# EAGLE design untitled (EAGLE 9.6.2)
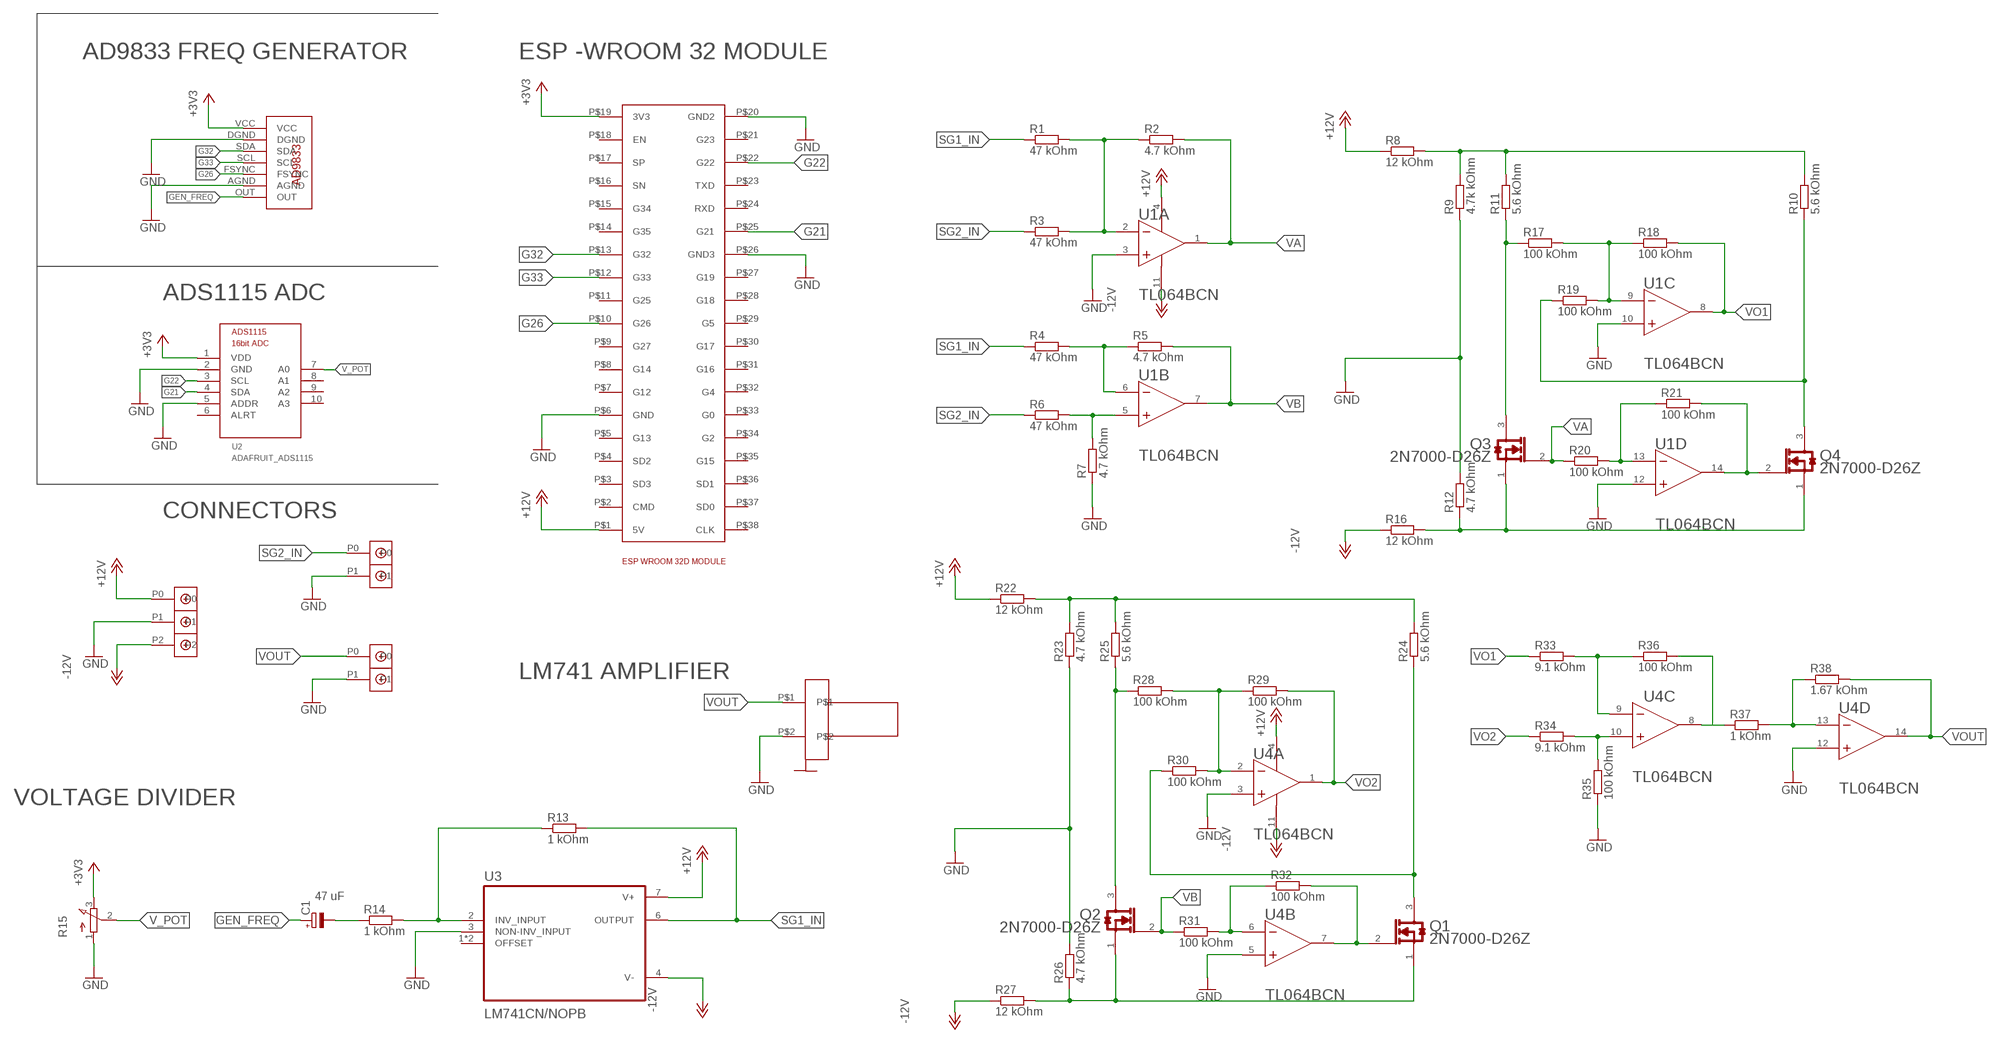
[diagram p0: schematic, sheet 1]

## Parts
C1  47 uF  CPOL-EUE1.8-4  [E1,8-4]
Q1  ON_SEMICONDUCTOR_2N7000-D26ZON_SEMICONDUCTOR_2N7000-D26Z_0_0  [ON_SEMICONDUCTOR_2N7000-D26Z_0]
Q2  ON_SEMICONDUCTOR_2N7000-D26ZON_SEMICONDUCTOR_2N7000-D26Z_0_0  [ON_SEMICONDUCTOR_2N7000-D26Z_0]
Q3  ON_SEMICONDUCTOR_2N7000-D26ZON_SEMICONDUCTOR_2N7000-D26Z_0_0  [ON_SEMICONDUCTOR_2N7000-D26Z_0]
Q4  ON_SEMICONDUCTOR_2N7000-D26ZON_SEMICONDUCTOR_2N7000-D26Z_0_0  [ON_SEMICONDUCTOR_2N7000-D26Z_0]
R1  47 kOhm  R-EU_0204/7  [0204/7]
R2  4.7 kOhm  R-EU_0204/7  [0204/7]
R3  47 kOhm  R-EU_0204/7  [0204/7]
R4  47 kOhm  R-EU_0204/7  [0204/7]
R5  4.7 kOhm  R-EU_0204/7  [0204/7]
R6  47 kOhm  R-EU_0204/7  [0204/7]
R7  4.7 kOhm  R-EU_0204/7  [0204/7]
R8  12 kOhm  R-EU_0204/7  [0204/7]
R9  4.7k kOhm  R-EU_0204/7  [0204/7]
R10  5.6 kOhm  R-EU_0204/7  [0204/7]
R11  5.6 kOhm  R-EU_0204/7  [0204/7]
R12  4.7 kOhm  R-EU_0204/7  [0204/7]
R13  1 kOhm  R-EU_0204/7  [0204/7]
R14  1 kOhm  R-EU_0204/7  [0204/7]
R15  3RP/1610N  [3RP/1610N]
R16  12 kOhm  R-EU_0204/7  [0204/7]
R17  100 kOhm  R-EU_0204/7  [0204/7]
R18  100 kOhm  R-EU_0204/7  [0204/7]
R19  100 kOhm  R-EU_0204/7  [0204/7]
R20  100 kOhm  R-EU_0204/7  [0204/7]
R21  100 kOhm  R-EU_0204/7  [0204/7]
R22  12 kOhm  R-EU_0204/7  [0204/7]
R23  4.7 kOhm  R-EU_0204/7  [0204/7]
R24  5.6 kOhm  R-EU_0204/7  [0204/7]
R25  5.6 kOhm  R-EU_0204/7  [0204/7]
R26  4.7 kOhm  R-EU_0204/7  [0204/7]
R27  12 kOhm  R-EU_0204/7  [0204/7]
R28  100 kOhm  R-EU_0204/7  [0204/7]
R29  100 kOhm  R-EU_0204/7  [0204/7]
R30  100 kOhm  R-EU_0204/7  [0204/7]
R31  100 kOhm  R-EU_0204/7  [0204/7]
R32  100 kOhm  R-EU_0204/7  [0204/7]
R33  9.1 kOhm  R-EU_0204/7  [0204/7]
R34  9.1 kOhm  R-EU_0204/7  [0204/7]
R35  100 kOhm  R-EU_0204/7  [0204/7]
R36  100 kOhm  R-EU_0204/7  [0204/7]
R37  1 kOhm  R-EU_0204/7  [0204/7]
R38  1.67 kOhm  R-EU_0204/7  [0204/7]
U1  TEXAS_INSTRUMENTS_TL064BCNTEXAS_INSTRUMENTS_TL064BCN_0_0  [TEXAS_INSTRUMENTS_TL064BCN_0]
U2  ADAFRUIT_ADS1115  [ADAFRUIT_ADS1115_16BIT_I2C_ADC]
U3  LM741CN/NOPB  [DIP794W45P254L959H508Q8]
U4  TEXAS_INSTRUMENTS_TL064BCNTEXAS_INSTRUMENTS_TL064BCN_0_0  [TEXAS_INSTRUMENTS_TL064BCN_0]
U$1  ESP32  [ESP32]
U$2  A9833  [AD9833]
U$3  DBCONN-1X2  [DBCONN-1X2]
U$4  DBCONN-1X3  [DBCONN-1X3]
U$5  DBCONN-1X2  [DBCONN-1X2]
U$6  FP  [FP]

## Nets
+3V3: R15.3(E) U2.1(VDD) U$1.P$19(3V3) U$2.VCC
+12V: R8.1 R22.1 U1.4(A:VCC+) U3.7(V+) U4.4(A:VCC+) U$1.P$1(5V) U$4.P0
-12V: R16.1 R27.1 U1.11(A:VCC-) U3.4(V-) U4.11(A:VCC-) U$4.P2
G21: U2.4(SDA) U$1.P$25(G21)
G22: U2.3(SCL) U$1.P$22(G22)
G26: U$1.P$10(G26) U$2.FSYNC
G32: U$1.P$13(G32) U$2.SDA
G33: U$1.P$12(G33) U$2.SCL
GEN_FREQ: C1.+ U$2.OUT
GND: R7.1 R9.1 R12.2 R15.1(A) R23.1 R26.2 R35.1 U1.3(A:IN1+) U1.10(C:IN3+) U1.12(D:IN4+) U2.2(GND) U2.5(ADDR) U3.3(NON-INV_INPUT) U4.3(A:IN1+) U4.5(B:IN2+) U4.12(D:IN4+) U$1.P$6(GND) U$1.P$20(GND2) U$1.P$26(GND3) U$2.AGND U$2.DGND U$3.P1 U$4.P1 U$5.P1 U$6.P$2
N$1: R1.2 R2.1 R3.2 U1.2(A:IN1-)
N$2: R4.2 R5.1 U1.6(B:IN2-)
N$3: R8.2 R9.2 R10.2 R11.2
N$4: R13.1 R14.2 U3.2(INV_INPUT)
N$5: C1.- R14.1
N$6: R6.2 R7.2 U1.5(B:IN2+)
N$7: Q3.3(D) R11.1 R17.1
N$8: Q3.1(S) Q4.1(S) R12.1 R16.2
N$9: Q4.3(D) R10.1 R19.1
N$10: R37.2 R38.1 U4.13(D:IN4-)
N$11: R20.2 R21.1 U1.13(D:IN4-)
N$12: R17.2 R18.1 R19.2 U1.9(C:IN3-)
N$13: Q4.2(G) R21.2 U1.14(D:OUT4)
N$14: R22.2 R23.2 R24.2 R25.2
N$15: Q1.1(S) Q2.1(S) R26.1 R27.2
N$16: Q2.3(D) R25.1 R28.1
N$17: Q1.3(D) R24.1 R30.1
N$18: R28.2 R29.1 R30.2 U4.2(A:IN1-)
N$19: R33.2 R36.1 U4.9(C:IN3-)
N$20: R31.2 R32.1 U4.6(B:IN2-)
N$21: Q1.2(G) R32.2 U4.7(B:OUT2)
N$23: R36.2 R37.1 U4.8(C:OUT3)
N$24: R34.2 R35.2 U4.10(C:IN3+)
SG1_IN: R1.1 R4.1 R13.2 U3.6(OUTPUT)
SG2_IN: R3.1 R6.1 U$3.P0
V_POT: R15.2(S) U2.7(A0)
VA: Q3.2(G) R2.2 R20.1 U1.1(A:OUT1)
VB: Q2.2(G) R5.2 R31.1 U1.7(B:OUT2)
VO1: R18.2 R33.1 U1.8(C:OUT3)
VO2: R29.2 R34.1 U4.1(A:OUT1)
VOUT: R38.2 U4.14(D:OUT4) U$5.P0 U$6.P$1
Unconnected: U2.6(ALRT) U2.8(A1) U2.9(A2) U2.10(A3) U3.1(OFFSET) U3.5(OFFSET) U$1.P$2(CMD) U$1.P$3(SD3) U$1.P$4(SD2) U$1.P$5(G13) U$1.P$7(G12) U$1.P$8(G14) U$1.P$9(G27) U$1.P$11(G25) U$1.P$14(G35) U$1.P$15(G34) U$1.P$16(SN) U$1.P$17(SP) U$1.P$18(EN) U$1.P$21(G23) U$1.P$23(TXD) U$1.P$24(RXD) U$1.P$27(G19) U$1.P$28(G18) U$1.P$29(G5) U$1.P$30(G17) U$1.P$31(G16) U$1.P$32(G4) U$1.P$33(G0) U$1.P$34(G2) U$1.P$35(G15) U$1.P$36(SD1) U$1.P$37(SD0) U$1.P$38(CLK)

## Notes on the sheet
- AD9833 FREQ GENERATOR | ESP -WROOM 32 MODULE
- ADS1115 ADC
- CONNECTORS
- LM741 AMPLIFIER
- VOLTAGE DIVIDER

## Library data of the parts
C1 = rcl:CPOL-EU: POLARIZED CAPACITOR, European symbol; SPICEPREFIX: C
Q1-Q4 = ON Semiconductor - 2N7000-D26Z:ON_SEMICONDUCTOR_2N7000-D26Z: Transistor Mosfet N-ch 60V 0.2A 3-PIN TO-92 T/r; AUTOMOTIVE: No; CENTROID_NOT_SPECIFIED: No; CONTINUOUS_DRAIN_CURRENT: 200mA; DATASHEET: https://www.onsemi.com/pdf/datasheet/nds7002a-d.pdf; DEPLETION_MODE: False; DEVICE_CLASS_L1: Discrete Semiconductors; DEVICE_CLASS_L2: Transistors; DEVICE_CLASS_L3: MOSFETs; DIGIKEY_DESCRIPTION: MOSFET N-CH 60V 200MA TO92-3; DIGIKEY_PART_NUMBER: 2N7000-D26ZCT-ND; DRAIN_TO_SOURCE_BREAKDOWN_VOLTAGE: 60V; DRAIN_TO_SOURCE_RESISTANCE: 1.2Ω; DRAIN_TO_SOURCE_VOLTAGE: 60V; FOOTPRINT_VARIANT_NAME_0: Recommended_Land_Pattern; GATE_TO_SOURCE_VOLTAGE: 20V; HEIGHT: 8.77mm; INPUT_CAPACITACE_AT_VDS: 20pF @ 25V; LEAD_FREE: Yes; MAX_FORWARD_DIODE_VOLTAGE: 1.5V; MAX_JUNCTION_TEMP: +150°C; MF: ON Semiconductor; MFG_PACKAGE_IDENT: 135AR; MFG_PACKAGE_IDENT_COMPONENT_ID: 9652051e5763c9af; MFG_PACKAGE_IDENT_DATE: 09/2016; MFG_PACKAGE_IDENT_REV: O; MOUSER_DESCRIPTION: N-Channel 60 V 5 Ohm Enhancement Mode Field Effect Transistor-TO-92; MOUSER_PART_NUMBER: 512-2N7000D26Z; MPN: 2N7000-D26Z; NUMBER_OF_CHANNELS: 1; NUMBER_OF_N_CHANNELS: 1; PACKAGE: TO92; POWER_DISSIPATION: 400mW; PREFIX: Q; PULSE_DRAIN_CURRENT: 500mA; ROHS: Yes; RTHJA_MAX: 312.5°C/W; STANDOFF_HEIGHT: 2.54mm; TEMPERATURE_RANGE_HIGH: +150°C; TEMPERATURE_RANGE_LOW: -55°C; THRESHOLD_VGS_MAX: 3V; THRESHOLD_VGS_MIN: 0.8V; TRANSCONDUCTANCE: 0.32S; TURN_OFF_DELAY_TIME: 10ns; TURN_ON_DELAY_TIME: 10ns; TYP_FORWARD_DIODE_VOLTAGE: 0.88V; VERIFICATION_VERSION: 0.0.0.3
R1-R14 R16-R38 = rcl:R-EU_: RESISTOR, European symbol; SPICEPREFIX: R
R15 = pot:3RP/1610N: 16mm Potentiometer one level Source: http://www.alphapotentiometers.net/html/16mm_pot_2.html
U1 U4 = Texas Instruments - TL064BCN:TEXAS_INSTRUMENTS_TL064BCN: TI-TLXX4X_MC3403-X14; CIIVA_IDS: 13597074; CMRR_MIND_B: 80; CODE__JEDEC: MS-001; COMPONENT_LINK_1_DESCRIPTION: Manufacturer URL; COMPONENT_LINK_1_URL: http://www.ti.com/; COMPONENT_LINK_3_DESCRIPTION: Package Specification; COMPONENT_LINK_3_URL: http://www.ti.com/lit/ml/mpdi002c/mpdi002c.pdf; DATASHEET: http://www.ti.com/lit/ds/symlink/tl064b.pdf; DATASHEET_VERSION: SLOS078J; FOOTPRINT_VARIANT_NAME_0: Manufacturer Recommended; GBW_TYP_MHZ: 1; IIB_MAXP_A: 200; IMPORTED: yes; IMPORTED_FROM: vault; IMPORT_TS: 1521848179; IQ_PER_CHANNELMAXMA: 0.25; MF: Texas Instruments; MOUNTING_TECHNOLOGY: Through Hole; MPN: TL064BCN; NUMBER_OF_CHANNELS: 4; OFFSET_DRIFTTYPUVC: 10; PACKAGE: N0014A; PACKAGE_DESCRIPTION: 14-Pin Plastic In-Line, Body 19.305 x 6.35 mm, Pitch 2.54 mm; PACKAGE_VERSION: 4040049/E, 12/2002; PREFIX: U; RATING: Catalog; RELEASE_DATE: 1464177968; ROHS: Yes; SLEW_RATETYPVUS: 3.5; SUB_FAMILY: General Purpose Amplifier, High Supply Voltage Amplifier (>=30V), Low Power Amp (<=500uA); TOTAL_SUPPLY_VOLTAGEMAX5V_IS_5__5V_IS_10: 36; TOTAL_SUPPLY_VOLTAGEMIN5V_IS_5__5V_IS_10: 7; VAULT_GUID: 55F2E253-B78A-4D80-B08A-0007F9876C2C; VAULT_REVISION: 1256BF72-5E93-4EA1-B475-6599D60DA280; VIO_25CMAXMV: 3; VN_AT_1KHZTYPNVRTHZ: 42
U2 = ADS1115:ADAFRUIT_ADS1115
U3 = LM741CN_NOPB:LM741CN/NOPB: Check availability <https://pricing.snapeda.com/parts/LM741CN/Texas%20Instruments/view-part?ref=eda>; AVAILABILITY: In Stock; DESCRIPTION: Operational Amplifiers - Op Amps Operational Amplifier 8-PDIP 0 to 70; MF: Texas Instruments; MP: LM741CN; PACKAGE: DIP-8 NXP Semiconductors; PRICE: None; PURCHASE-URL: https://pricing.snapeda.com/search?q=LM741CN&ref=eda
U$1 = [module]ESP32:ESP32
U$2 = AD9833:A9833
U$3 U$5 = Terminal Block Connector:DBCONN-1X2
U$4 = Terminal Block Connector:DBCONN-1X3
U$6 = AUDIO MONO:FP

## Board
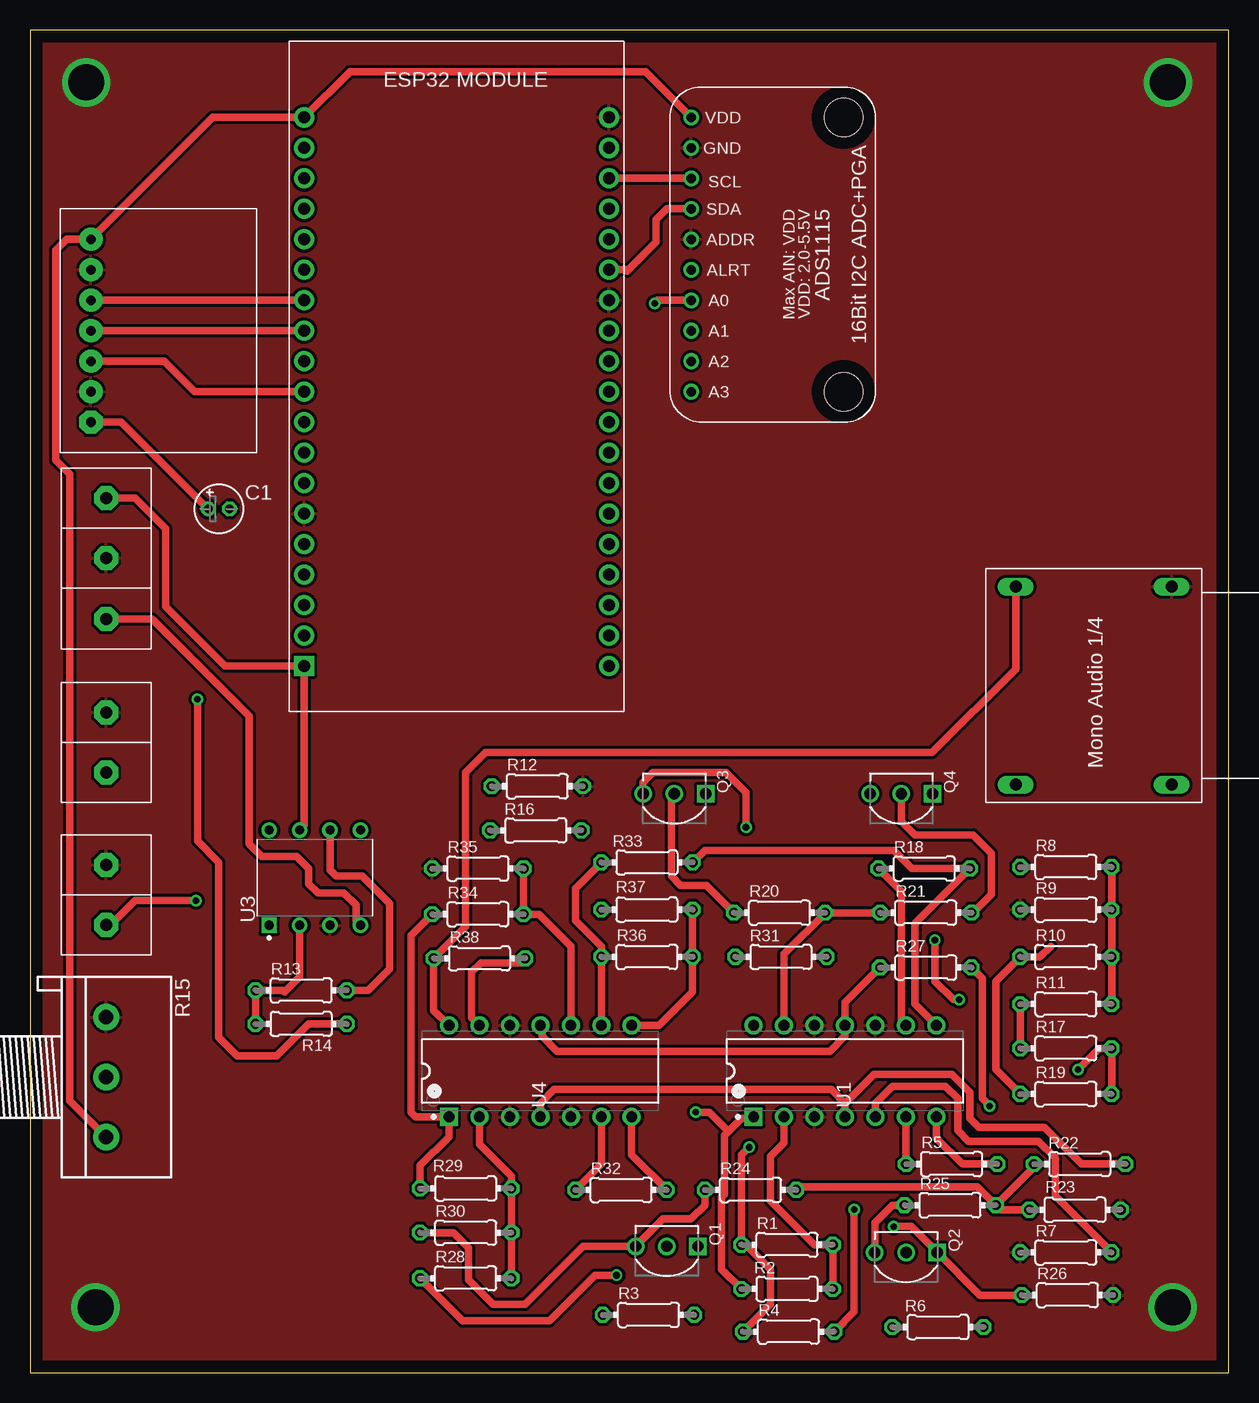
[diagram p1: board, top side]
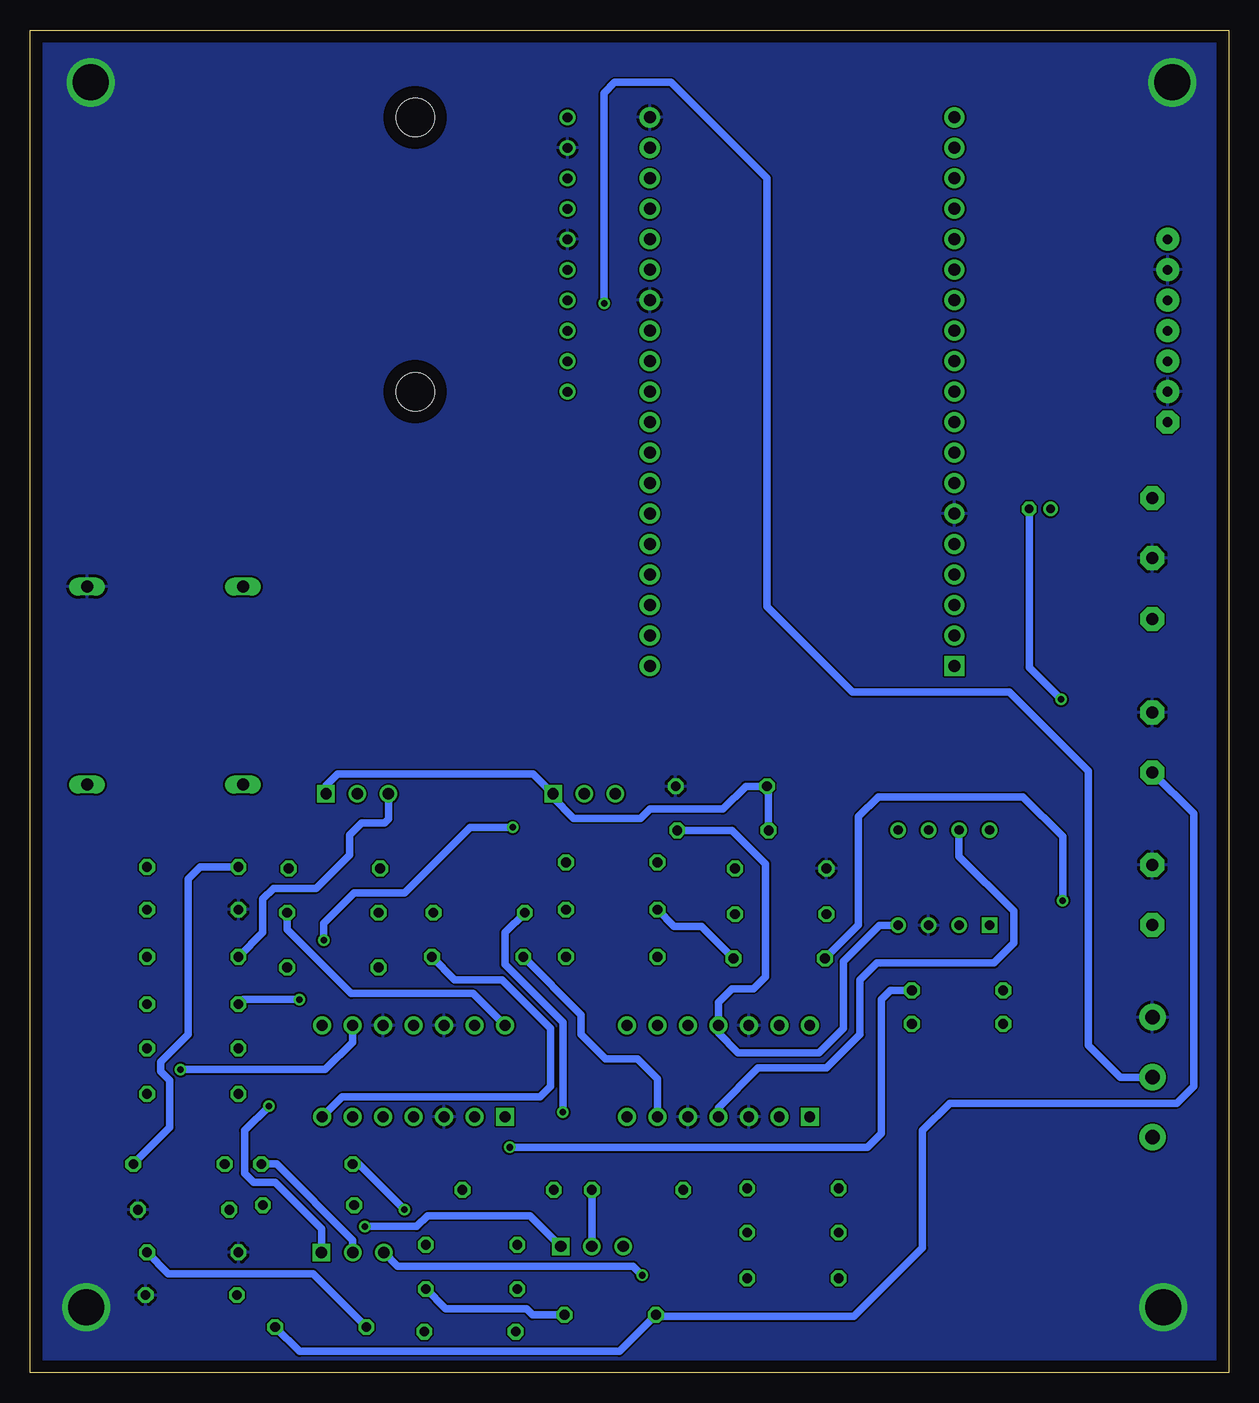
[diagram p2: board, bottom side, seen from below]

Size 99.93 x 111.94 mm. Coordinates in mm from the lower left corner, seen from the top.
Outline: 0,0 99.93,0 99.93,111.94 0,111.94 0,0
Copper layers (1*16): Top 0.035mm / dielectric 1.5mm / Bottom 0.035mm
Design rules "default": minimum track width 6mil, minimum drill 0.35mm, track to track 6mil, track to pad 6mil, pad to pad 6mil, via to via 6mil, smd to smd 6mil, copper to edge 40mil, drill to drill 6mil, minimum pad ring 10mil, minimum via ring 8mil, stop-mask expansion 4mil, vias tented up to drill 0mil, thermal gap 10mil

### Footprints (pad centres in the part's own frame; a part is rotated, then mirrored left to right if it is on the bottom)
E1,8-4 = drill 0.711 pad 1.168: + -0.889,0 | drill 0.711 pad 1.168 octagon: - 0.889,0
ON_SEMICONDUCTOR_2N7000-D26Z_0 = drill 0.95 pad 1.45 square: 1 -0.38,2.6 | drill 0.95 pad 1.45: 2 -0.38,0; 3 -0.38,-2.6
0204/7 = drill 0.813 octagon: 1 -3.81,0; 2 3.81,0
3RP/1610N = drill 1.2 pad 2.184: 1 -5,0; 2 0,0; 3 5,0
TEXAS_INSTRUMENTS_TL064BCN_0 = drill 0.9 pad 1.5 square: 1 -3.81,7.62 | drill 0.9 pad 1.5: 2 -3.81,5.08; 3 -3.81,2.54; 4 -3.81,0; 5 -3.81,-2.54; 6 -3.81,-5.08; 7 -3.81,-7.62; 8 3.81,-7.62; 9 3.81,-5.08; 10 3.81,-2.54; 11 3.81,0; 12 3.81,2.54; 13 3.81,5.08; 14 3.81,7.62
ADAFRUIT_ADS1115_16BIT_I2C_ADC = drill 0.8: 1 2.54,1.778; 2 5.08,1.778; 3 7.62,1.778; 4 10.16,1.778; 5 12.7,1.778; 6 15.24,1.778; 7 17.78,1.778; 8 20.32,1.778; 9 22.86,1.778; 10 25.4,1.778 | hole 3.2: 2.54,14.478; 25.4,14.478
DIP794W45P254L959H508Q8 = drill 0.78 pad 1.13 square: 1 -3.97,3.81 | drill 0.78 pad 1.13: 2 -3.97,1.27; 3 -3.97,-1.27; 4 -3.97,-3.81; 5 3.97,-3.81; 6 3.97,-1.27; 7 3.97,1.27; 8 3.97,3.81
ESP32 = drill 1 pad 1.676 square: P$1 1.27,3.81 | drill 1 pad 1.676: P$2 1.27,6.35; P$3 1.27,8.89; P$4 1.27,11.43; P$5 1.27,13.97; P$6 1.27,16.51; P$7 1.27,19.05; P$8 1.27,21.59; P$9 1.27,24.13; P$10 1.27,26.67; P$11 1.27,29.21; P$12 1.27,31.75; P$13 1.27,34.29; P$14 1.27,36.83; P$15 1.27,39.37; P$16 1.27,41.91; P$17 1.27,44.45; P$18 1.27,46.99; P$19 1.27,49.53; P$20 26.67,49.53; P$21 26.67,46.99; P$22 26.67,44.45; P$23 26.67,41.91; P$24 26.67,39.37; P$25 26.67,36.83; P$26 26.67,34.29; P$27 26.67,31.75; P$28 26.67,29.21; P$29 26.67,26.67; P$30 26.67,24.13; P$31 26.67,21.59; P$32 26.67,19.05; P$33 26.67,16.51; P$34 26.67,13.97; P$35 26.67,11.43; P$36 26.67,8.89; P$37 26.67,6.35; P$38 26.67,3.81
AD9833 = drill 0.8 pad 1.93: AGND 0,2.54; DGND 0,12.7; FSYNC 0,5.08; SCL 0,7.62; SDA 0,10.16; VCC 0,15.24 | drill 0.8 pad 1.93 octagon: OUT 0,0
DBCONN-1X2 = drill 1 pad 2 octagon: P0 -2.54,0; P1 2.46,0
DBCONN-1X3 = drill 1 pad 2 octagon: P0 2.54,3.81; P1 7.54,3.81; P2 12.62,3.81
FP = drill 1 long: P$1 0,0; P$2 0,13; P$3 16.5,13; P$4 16.5,0

### Placement (x,y rotation side)
C1  15.75,72.01 0 top
Q1  53.09,10.16 270 top
Q2  73.03,9.65 270 top
Q3  53.72,47.88 270 top
Q4  72.64,47.88 270 top
R1  63.12,10.67 0 top
R2  63.12,6.99 180 top
R3  51.56,4.83 0 top
R4  63.25,3.43 0 top
R5  76.83,17.4 0 top
R6  75.69,3.81 180 top
R7  86.36,10.03 0 top
R8  86.36,42.16 0 top
R9  86.36,38.61 0 top
R10  86.36,34.67 0 top
R11  86.36,30.73 0 top
R12  42.29,48.9 0 top
R13  22.61,31.88 0 top
R14  22.61,29.08 180 top
R15  6.35,24.64 270 top
R16  42.16,45.21 180 top
R17  86.36,27.05 0 top
R18  74.55,42.04 0 top
R19  86.36,23.24 0 top
R20  62.48,38.35 0 top
R21  74.68,38.35 0 top
R22  87.5,17.4 180 top
R23  87.12,13.59 180 top
R24  60.07,15.24 0 top
R25  76.71,13.97 0 top
R26  86.49,6.48 0 top
R27  74.68,33.78 0 top
R28  36.32,7.87 0 top
R29  36.32,15.37 180 top
R30  36.32,11.68 0 top
R31  62.61,34.67 180 top
R32  49.28,15.24 0 top
R33  51.44,42.55 180 top
R34  37.34,38.23 0 top
R35  37.34,42.04 0 top
R36  51.44,34.67 0 top
R37  51.44,38.61 180 top
R38  37.47,34.54 180 top
U1  67.94,25.15 90 top
U2  53.34,107.19 270 top
U3  23.75,41.27 90 top
U4  42.55,25.15 90 top
U$1  21.59,55.12 0 top
U$2  5.08,79.25 0 top
U$3  6.35,52.58 90 top
U$4  2.54,75.44 270 top
U$5  6.35,39.88 90 top
U$6  82.17,65.53 270 top

### Tracks (layer width: path | path; a pad name or v marks a point on that pad's centre or on a via)
+3V3
  Top 0.61: U2.1 51.31,108.46 26.67,108.46 U$1.P$19 15.24,104.65 U$2.VCC 3.05,94.49 2.16,93.6 2.16,76.07 3.3,74.93 3.3,22.69 R15.3
+12V
  Top 0.61: U4.4 42.55,22.48 43.69,23.62 66.8,23.62 67.94,22.48 | 67.94,22.48 U1.4 | U$4.P0 8.76,72.9 11.3,70.36 11.3,63.88 16.26,58.93 U$1.P$1 22.86,45.63 U3.7 | R22.1 87.63,17.4 84.58,20.45 79.12,20.45 78.36,21.21 78.36,23.37 76.83,24.89 70.36,24.89 67.94,22.48
  Bottom 0.61: U3.7 22.48,43.05 17.91,38.48 17.91,35.81 19.56,34.16 29.34,34.16 30.73,32.77 30.73,28.19 33.53,25.4 39.24,25.4 42.55,22.1 U4.4 | R22.1 88.27,20.45 88.27,24.38 89.03,25.15 89.03,25.91 86.74,28.19 86.74,41.15 85.72,42.16 R8.1
-12V
  Top 0.61: U4.11 42.67,28.83 42.67,28.07 43.94,26.8 66.67,26.8 67.94,28.07 U1.11 67.94,30.86 R27.1 | U3.4 27.18,37.69 27.18,38.99 26.16,40.01 24,40.01 23.24,40.77 23.24,42.04 22.23,43.05 19.3,43.05 18.29,44.07 18.29,54.74 10.21,62.82 U$4.P2
  Bottom 0.61: R16.1 41.4,45.21 38.61,42.42 38.61,33.02 39.62,32 41.4,32 42.55,30.86 U4.11 42.55,28.32 40.89,26.67 34.16,26.67 32.13,28.7 32.13,34.29 29.12,37.3 U3.4
G21
  Top 0.61: U$1.P$25 49.66,91.95 49.78,91.82 52.2,94.23 52.2,96.14 53.09,97.03 U2.4
G22
  Top 0.61: U$1.P$22 U2.3
G26
  Top 0.61: U$2.FSYNC 11.18,84.33 13.72,81.79 U$1.P$10
G32
  Top 0.61: U$2.SDA U$1.P$13
G33
  Top 0.61: U$2.SCL U$1.P$12
GEN_FREQ
  Top 0.61: C1.+ 7.62,79.25 U$2.OUT
GND  (via drill 3)
  other vias: 4.7,107.57 95.25,5.46 5.46,5.46 94.87,107.57
  pour Top (isolate 0.254): 0,112.14 0,-0.13 125.35,-0.13 125.35,112.14
  pour Bottom: 0.38,112.01 0.38,0.38 0.64,0.13 124.97,0.13 125.09,0.25 125.09,111.76 124.97,111.89 0.64,111.89 0.51,112.01
N$1
  Top 0.61: U1.2 62.87,19.18 61.72,18.03 61.72,14.35 65.41,10.67 R1.2 R2.1
  Bottom 0.61: R3.2 58.04,4.83 58.55,5.33 65.28,5.33 R2.1
N$2  (via drill 0.55)
  Top 0.61: R5.1 U1.6 | R4.2 68.71,5.08 v68.71,13.59
  Bottom 0.61: v68.71,13.59 72.52,17.4 R5.1
N$3
  Top 0.61: R11.2 R10.2 R9.2 R8.2
N$4
  Top 0.61: U3.2 22.48,33.02 21.21,31.75 21.08,31.88 R13.1 R14.2
N$5  (via drill 0.55)
  Top 0.61: v13.97,56.13 13.97,44.32 15.75,42.55 15.75,27.94 17.27,26.42 20.57,26.42 23.24,29.08 R14.1
  Bottom 0.61: C1.- 16.64,58.8 v13.97,56.13
N$6
  Top 0.61: R7.2 85.47,14.73 85.47,17.91 84.07,19.3 78.23,19.3 77.34,20.19 77.34,22.86 76.33,23.88 71.88,23.88 70.48,22.48 U1.5
  Bottom 0.61: R6.2 76.33,8.26 88.39,8.26 R7.2
N$7  (via drill 0.55)
  Top 0.61: R17.1 R11.1 | Q3.3 51.12,49.22 51.94,50.04 58.04,50.04 59.69,48.39 v59.69,45.47 | v75.44,36.07 75.44,32.64 76.96,31.12 v77.47,31.12
  Bottom 0.61: v59.69,45.47 63.25,45.47 68.71,40.01 72.9,40.01 75.44,37.47 v75.44,36.07 | v77.47,31.12 82.17,31.12 R11.1
N$8
  Bottom 0.61: R16.2 38.35,48.77 R12.1 40.26,48.9 42.16,46.99 48.26,46.99 49.02,46.23 54.61,46.23 56.32,47.94 Q3.1 57.97,49.91 74.3,49.91 75.24,48.96 Q4.1
N$9
  Top 0.61: R19.1 80.52,25.27 80.52,32.64 R10.1 84.2,34.67 85.09,35.56
  Bottom 0.61: R10.1 80.52,36.7 80.52,39.5 79.63,40.39 76.07,40.39 73.28,43.18 73.28,44.83 72.26,45.85 70.36,45.85 70.04,46.16 Q4.3
N$10
  Top 0.61: R38.1 40.89,34.16 37.59,34.16 36.83,33.4 36.83,29.59 U4.13
  Bottom 0.61: R37.2 46.23,37.21 43.94,37.21 R38.1
N$11
  Top 0.61: R21.1 R20.2 62.87,34.92 U1.13
N$12  (via drill 0.55)
  Top 0.61: U1.9 72.64,29.34 72.64,40.13 R18.1 | R19.2 R17.2 89.15,27.05 v87.38,25.27
  Bottom 0.61: v87.38,25.27 75.31,25.27 73.03,27.56 U1.9
N$13
  Top 0.61: Q4.2 72.64,45.97 73.79,44.83 78.61,44.83 80.14,43.31 80.14,39.88 78.61,38.35 R21.2
  Bottom 0.61: U1.14 62.99,31.62 73.15,31.62 78.49,36.96 R21.2
N$14
  Top 0.61: R25.2 78.99,15.49 64.14,15.49 R24.2 | R22.2 83.69,17.14 R25.2 | R23.2 80.9,13.59 R25.2
N$15  (via drill 0.55)
  Top 0.61: R26.1 79.18,6.48 Q2.1 73.47,12.19 v72.01,12.19 | R27.2 79.38,32.89 79.38,22.86 v80.01,22.23
  Bottom 0.61: v80.01,22.23 82.04,20.19 82.04,16.64 81.28,15.88 79.5,15.88 75.62,12 Q2.1 | Q1.1 58.23,13.08 66.8,13.08 67.69,12.19 v72.01,12.19
N$16  (via drill 0.55)
  Top 0.61: R28.1 36.07,4.32 43.31,4.32 47.12,8.13 v48.9,8.13 | R25.1 71.88,13.97 70.42,12.51 Q2.3
  Bottom 0.61: v48.9,8.13 49.66,8.89 69.28,8.89 Q2.3
N$17
  Top 0.61: R24.1 56.26,13.97 55.12,12.83 52.77,12.83 Q1.3 46.1,10.54 41.27,5.72 38.61,5.72 36.58,7.75 36.58,10.41 35.31,11.68 R30.1
N$18
  Top 0.61: U4.2 37.47,19.05 40.13,16.38 R29.1 R30.2 R28.2
N$19
  Top 0.61: U4.9 R36.1 47.62,35.56 45.47,37.72 45.47,40.39 R33.2
N$20
  Top 0.61: R32.1 47.62,17.4 U4.6
  Bottom 0.61: R31.2 53.98,29.84 53.98,28.19 51.94,26.16 49.28,26.16 47.62,24.51 U4.6
N$21
  Top 0.61: R32.2 50.16,18.16 U4.7
  Bottom 0.61: Q1.2 R32.2
N$23
  Top 0.61: U4.8 52.45,28.96 55.24,31.75 R36.2 R37.1
N$24
  Top 0.61: R35.2 R34.2 42.42,38.23 45.09,35.56 U4.10
SG1_IN  (via drill 0.55)
  Top 0.61: R13.2 28.19,31.88 29.97,33.66 29.97,39.12 27.69,41.4 25.53,41.4 25.02,41.91 U3.6 | R4.1 61.72,5.72 61.72,8.64 59.69,10.67 R1.1 59.31,18.16 v59.94,18.8
  Bottom 0.61: v59.94,18.8 30.1,18.8 28.96,19.94 28.96,31.12 28.19,31.88 R13.2
SG2_IN
  Bottom 0.61: U$3.P0 2.92,46.61 2.92,23.88 4.32,22.48 23.24,22.48 25.53,20.19 25.53,10.41 31.24,4.7 47.62,4.7 R3.1 50.8,1.78 77.47,1.78 R6.1
V_POT  (via drill 0.55)
  Top 0.61: U2.7 52.32,89.41 v52.07,89.15
  Bottom 0.61: v52.07,89.15 52.07,106.68 51.18,107.57 46.48,107.57 38.48,99.57 38.48,63.88 31.37,56.77 18.29,56.77 11.68,50.16 11.68,27.3 9.02,24.64 R15.2
VA  (via drill 0.55)
  Top 0.61: R2.2 57.66,8.64 57.66,14.61 57.91,14.86 57.91,19.81 58.23,20.13 | 58.23,20.13 59.31,21.21 60.2,21.21 U1.1 | 58.23,20.13 56.64,21.72 v55.5,21.72 | Q3.2 53.47,48.01 53.47,41.4 54.23,40.64 56.39,40.64 R20.1
  Bottom 0.61: v55.5,21.72 55.5,29.21 60.33,34.04 60.33,36.7 R20.1
VB
  Top 0.61: U1.7 75.56,19.56 77.72,17.4 R5.2
  Bottom 0.61: Q2.2 73.03,11.05 79.38,17.4 R5.2 | R31.1 64.52,32.77 60.58,32.77 56.52,28.7 56.52,23.88 57.4,22.99 73.91,22.99 U1.7
VO1
  Top 0.61: U1.8 73.79,30.73 73.79,37.47 R18.2 73.53,42.04 72.01,43.56 56.26,43.56 R33.1
VO2
  Top 0.61: R34.1 31.75,36.45 31.75,21.72 32.13,21.34 U4.1 34.92,19.69 32.51,17.27 R29.2
VOUT  (via drill 0.55)
  Top 0.61: U4.14 33.66,30.23 R38.2 36.32,37.21 36.32,50.04 37.97,51.69 75.18,51.69 82.17,58.67 U$6.P$1 | v13.84,39.37 8.76,39.37 6.73,37.34 U$5.P0
  Bottom 0.61: R38.2 30.86,37.34 30.86,46.36 29.21,48.01 17.14,48.01 13.84,44.7 v13.84,39.37